# EAGLE design power_cleanup (EAGLE 9.3.0)
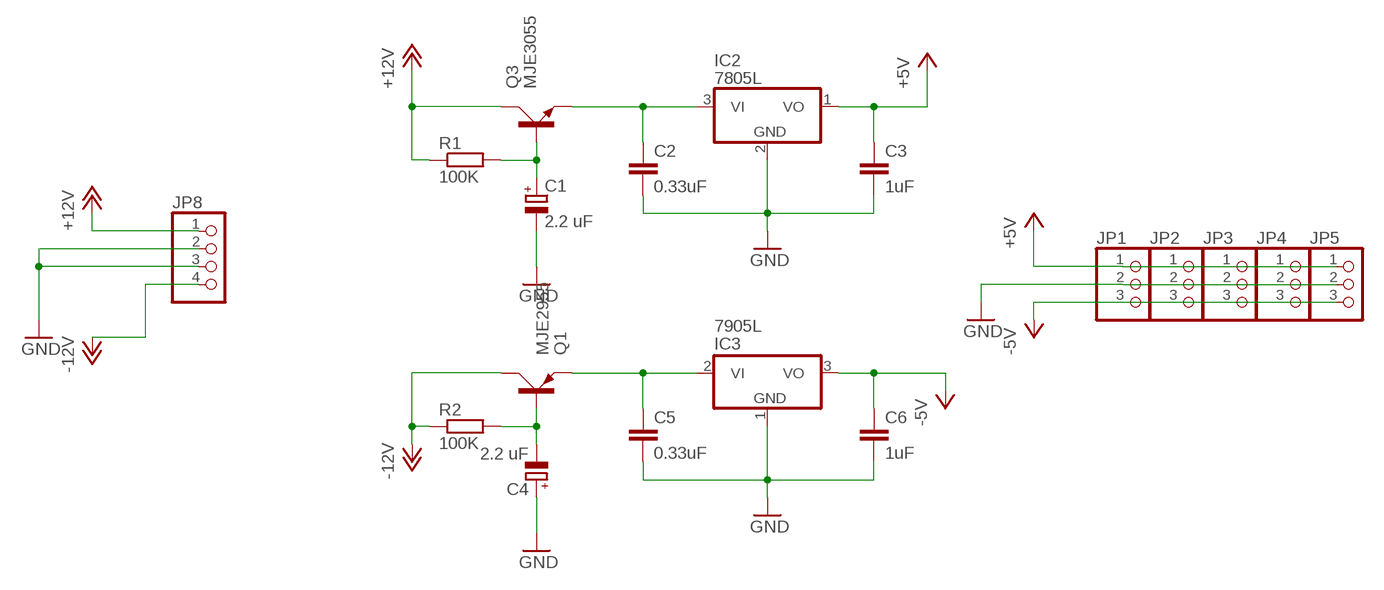
[diagram p0: schematic, sheet 1]

## Parts
C1  2.2 uF  CPOL-EUE2-5  [E2-5]
C2  0.33uF  C-EU025-025X050  [C025-025X050]
C3  1uF  C-EU025-025X050  [C025-025X050]
C4  2.2 uF  CPOL-EUE2-5  [E2-5]
C5  0.33uF  C-EU025-025X050  [C025-025X050]
C6  1uF  C-EU025-025X050  [C025-025X050]
IC2  7805L  [TO92]
IC3  7905L  [TO92]
JP1  PINHD-1X3  [1X03]
JP2  PINHD-1X3  [1X03]
JP3  PINHD-1X3  [1X03]
JP4  PINHD-1X3  [1X03]
JP5  PINHD-1X3  [1X03]
JP8  PINHD-1X4  [1X04]
Q1  MJE2955  [TO220AV]
Q3  MJE3055  [TO220AV]
R1  100K  R-EU_0207/10  [0207/10]
R2  100K  R-EU_0207/10  [0207/10]

## Nets
+5V: C3.1 IC2.1(VO) JP1.1 JP2.1 JP3.1 JP4.1 JP5.1
+12V: JP8.1 Q3.C R1.1
-5V: C6.1 IC3.3(VO) JP1.3 JP2.3 JP3.3 JP4.3 JP5.3
-12V: JP8.4 Q1.C R2.1
GND: C1.- C2.2 C3.2 C4.+ C5.2 C6.2 IC2.2(GND) IC3.1(GND) JP1.2 JP2.2 JP3.2 JP4.2 JP5.2 JP8.2 JP8.3
N$1: C1.+ Q3.B R1.2
N$2: C2.1 IC2.3(VI) Q3.E
N$4: C4.- Q1.B R2.2
N$5: C5.1 IC3.2(VI) Q1.E

## Library data of the parts
C1 C4 = rcl:CPOL-EU: POLARIZED CAPACITOR, European symbol; SPICEPREFIX: C
C2 C3 C5 C6 = rcl:C-EU: CAPACITOR, European symbol; SPICEPREFIX: C
IC2 = linear:78*: Positive VOLTAGE REGULATOR Source: http://cache.national.com/ds/LM/LM78L05.pdf http://www.fairchildsemi.com/ds/LM/LM7805.pdf
IC3 = linear:79*: Negative VOLTAGE REGULATOR
JP1-JP5 = pinhead:PINHD-1X3: PIN HEADER
JP8 = pinhead:PINHD-1X4: PIN HEADER
Q1 = transistor-power:MJE2955: PNP TRANSISTOR
Q3 = transistor-power:MJE3055: NPN TRANSISTOR
R1 R2 = rcl:R-EU_: RESISTOR, European symbol; SPICEPREFIX: R

## Net classes
0 Power: width 0.5 mm, drill 0.5 mm, clearance 0.5 mm

## Board
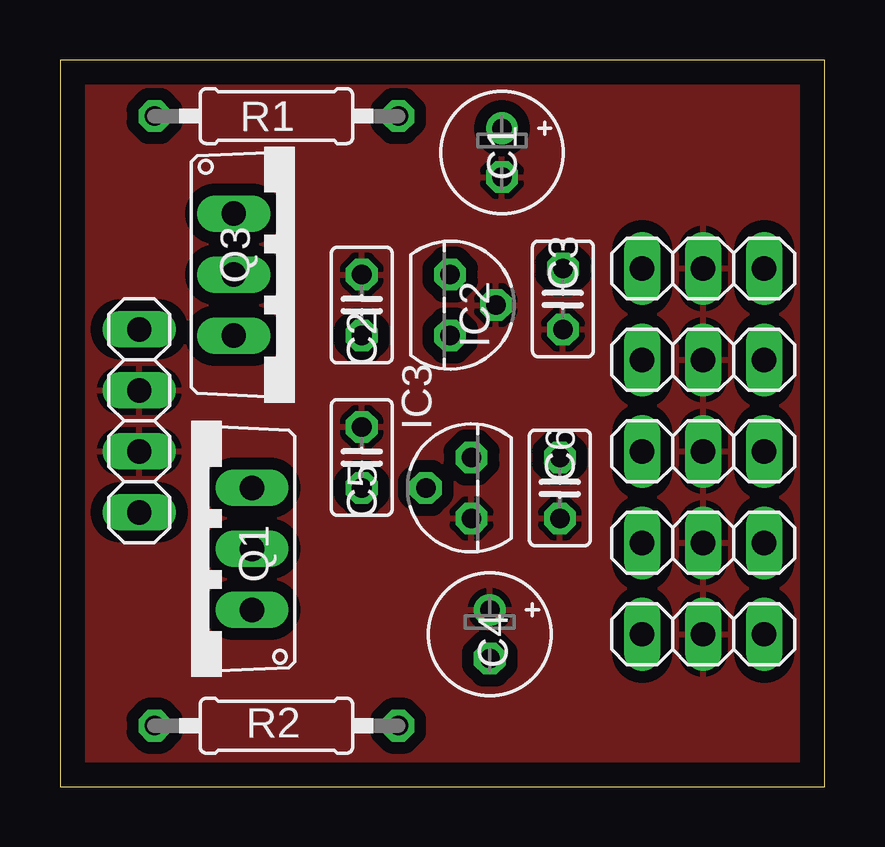
[diagram p1: board, top side]
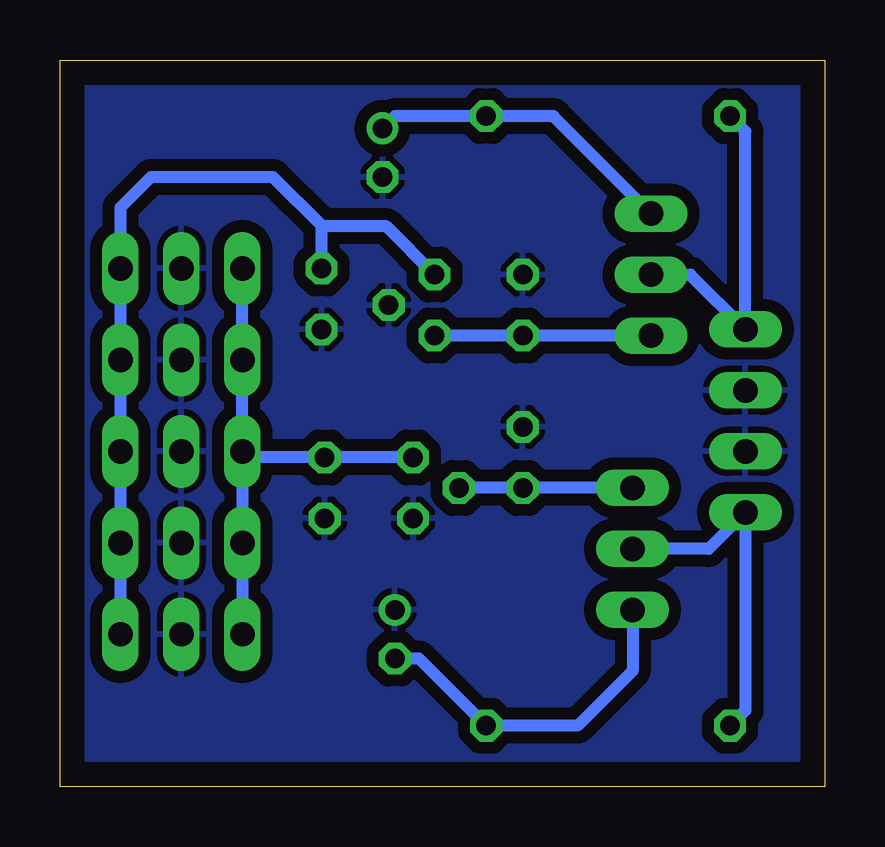
[diagram p2: board, bottom side, seen from below]

Size 31.86 x 30.28 mm. Coordinates in mm from the lower left corner, seen from the top.
Outline: 0,0 31.86,0 31.86,30.28 0,30.28 0,0
Copper layers (1*16): Top 0.035mm / dielectric 1.5mm / Bottom 0.035mm
Design rules "default": minimum track width 6mil, minimum drill 0.35mm, track to track 6mil, track to pad 6mil, pad to pad 6mil, via to via 6mil, smd to smd 6mil, copper to edge 40mil, drill to drill 6mil, minimum pad ring 10mil, minimum via ring 8mil, stop-mask expansion 4mil, vias tented up to drill 0mil, thermal gap 10mil

### Footprints (pad centres in the part's own frame; a part is rotated, then mirrored left to right if it is on the bottom)
E2-5 = drill 0.813 pad 1.27: + -1.016,0 | drill 0.813 pad 1.27 octagon: - 1.016,0
C025-025X050 = drill 0.813 octagon: 1 -1.27,0; 2 1.27,0
TO92 = drill 0.813 octagon: 1 -1.27,0; 2 0,1.905; 3 1.27,0
1X03 = drill 1.016 long: 1 -2.54,0; 2 0,0; 3 2.54,0
1X04 = drill 1.016 long: 1 -3.81,0; 2 -1.27,0; 3 1.27,0; 4 3.81,0
TO220AV = drill 1.016 long: B -2.54,-2.54; C 0,-2.54; E 2.54,-2.54
0207/10 = drill 0.813 octagon: 1 -5.08,0; 2 5.08,0

### Placement (x,y rotation side)
C1  18.41,26.42 270 top
C2  12.57,20.07 90 top
C3  20.95,20.32 270 top
C4  17.91,6.35 270 top
C5  12.57,13.72 90 top
C6  20.83,12.45 270 top
IC2  16.26,20.07 270 top
IC3  17.14,12.45 90 top
JP1  26.8,21.59 180 top
JP2  26.8,17.78 180 top
JP3  26.8,13.97 180 top
JP4  26.8,10.16 180 top
JP5  26.8,6.35 180 top
JP8  3.3,15.24 270 top
Q1  5.46,9.91 90 top
Q3  9.78,21.34 270 top
R1  9.02,27.94 0 top
R2  9.02,2.54 0 top

### Tracks (layer width: path | path; a pad name or v marks a point on that pad's centre or on a via)
+5V
  Bottom 0.5: C3.1 20.95,23.37 | 20.95,23.37 22.99,25.4 28.07,25.4 29.34,24.13 JP1.1 JP2.1 JP3.1 JP4.1 JP5.1 | 20.95,23.37 18.29,23.37 IC2.1
+12V
  Bottom 0.5: R1.1 3.3,27.3 JP8.1 5.59,21.34 Q3.C
-5V
  Bottom 0.5: JP3.3 24,13.72 C6.1 IC3.3 | JP3.3 JP2.3 JP1.3 | JP3.3 JP4.3 JP5.3
-12V
  Bottom 0.5: R2.1 3.3,3.17 JP8.4 4.83,9.91 Q1.C
GND
  pour Top: -4.95,-3.81 -4.95,57.15 -3.68,58.42 66.17,58.42 71.25,53.34 75.06,49.53 75.06,-2.54 73.79,-3.81
  pour Bottom: -2.41,-2.54 -2.41,50.8 6.48,59.69 58.55,59.69 77.6,40.64 77.6,0 76.33,-1.27 -1.14,-1.27
N$1
  Bottom 0.5: Q3.B 11.3,27.94 R1.2 17.91,27.94 C1.+
N$2
  Bottom 0.5: Q3.E C2.1 IC2.3
N$4
  Bottom 0.5: Q1.B 8,4.83 10.29,2.54 R2.2 16.89,5.33 C4.-
N$5
  Bottom 0.5: Q1.E C5.1 IC3.2